# Altium schematic sheet Schematic.SchDoc
size A2
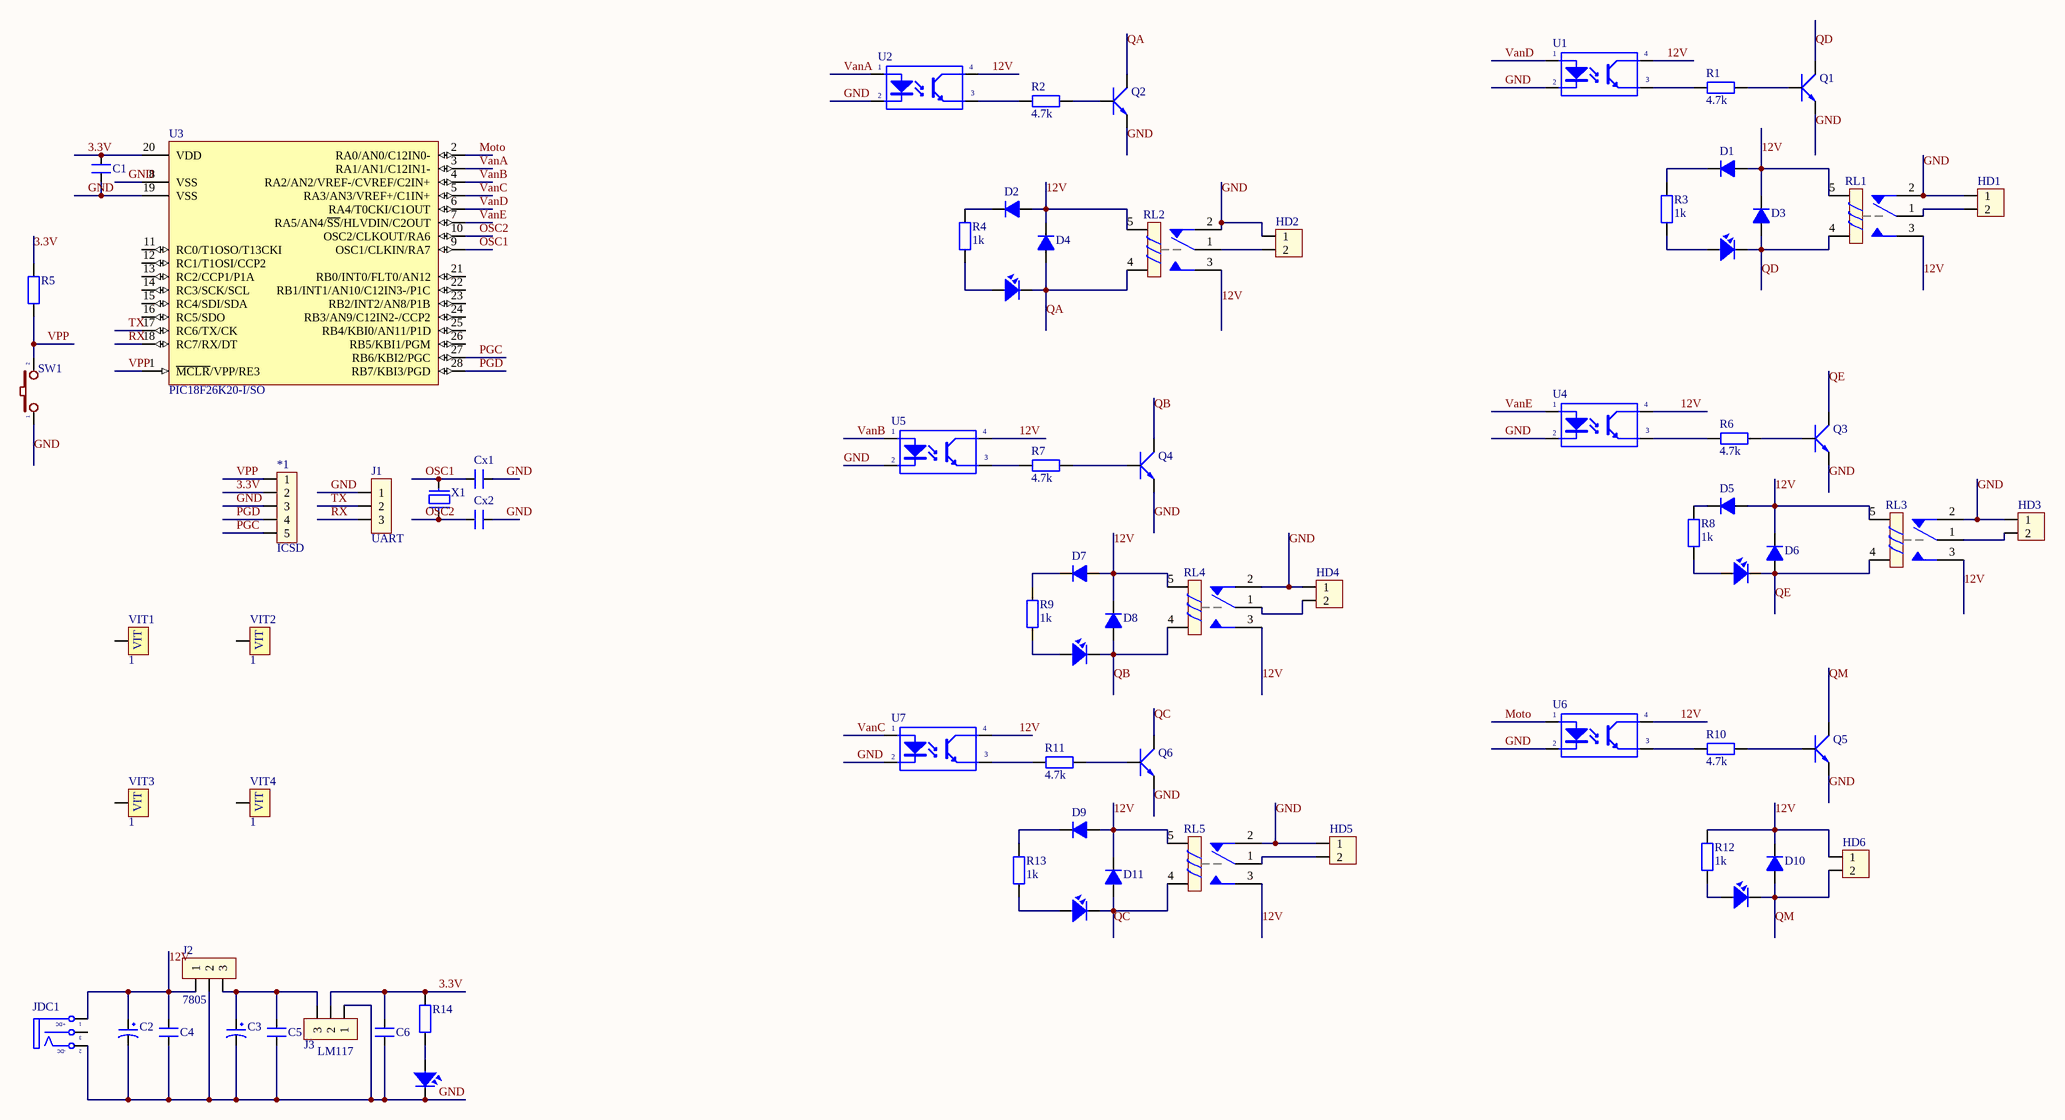
[diagram p0: Schematic.SchDoc]

## Parts
*1  ICSD  [CON5]
C1  104  [CN2]  (value not drawn)
C2  100uF/35V  [CP1.5/3.4]  (value not drawn)
C3  10uF  [CP1/2]  (value not drawn)
C4  104  [CN2]  (value not drawn)
C5  104  [CN2]  (value not drawn)
C6  104  [CN2]  (value not drawn)
Cx1  33pF  [CN1]  (value not drawn)
Cx2  33pF  [CN1]  (value not drawn)
D1  1N4007  [D1A]  (value not drawn)
D2  1N4007  [D1A]  (value not drawn)
D3  1N4007  [D1A]  (value not drawn)
D4  1N4007  [D1A]  (value not drawn)
D5  1N4007  [D1A]  (value not drawn)
D6  1N4007  [D1A]  (value not drawn)
D7  1N4007  [D1A]  (value not drawn)
D8  1N4007  [D1A]  (value not drawn)
D9  1N4007  [D1A]  (value not drawn)
D10  1N4007  [D1A]  (value not drawn)
D11  1N4007  [D1A]  (value not drawn)
HD1  Header 2  [CON2]  (value not drawn)
HD2  Header 2  [CON2]  (value not drawn)
HD3  Header 2  [CON2]  (value not drawn)
HD4  Header 2  [CON2]  (value not drawn)
HD5  Header 2  [CON2]  (value not drawn)
HD6  Header 2  [CON2]  (value not drawn)
J1  UART  [CON3]
J2  7805  [QTO-220H3]
J3  LM117  [QTO-220H3]
JDC1  Jac DC  [DC-IN]  (value not drawn)
LED1  LED  [LED-5TRED]  (value not drawn)
LED2  LED  [LED-5TRED]  (value not drawn)
LED3  LED  [LED-5TRED]  (value not drawn)
LED4  LED  [LED-5TRED]  (value not drawn)
LED5  LED  [LED-5TRED]  (value not drawn)
LED6  LED  [LED-5TRED]  (value not drawn)
LED7  LED  [LED-5TRED]  (value not drawn)
Q1  C1815  [QTO-92]  (value not drawn)
Q2  C1815  [QTO-92]  (value not drawn)
Q3  C1815  [QTO-92]  (value not drawn)
Q4  C1815  [QTO-92]  (value not drawn)
Q5  C1815  [QTO-92]  (value not drawn)
Q6  C1815  [QTO-92]  (value not drawn)
R1  4.7k  [R1/4W]
R2  4.7k  [R1/4W]
R3  1k  [R1/4W]
R4  1k  [R1/4W]
R5  1k  [R1/4W]  (value not drawn)
R6  4.7k  [R1/4W]
R7  4.7k  [R1/4W]
R8  1k  [R1/4W]
R9  1k  [R1/4W]
R10  4.7k  [R1/4W]
R11  4.7k  [R1/4W]
R12  1k  [R1/4W]
R13  1k  [R1/4W]
R14  1k  [R1/4W]  (value not drawn)
RL1  Relay 10A/12V  [RL_SPDT_10A]  (value not drawn)
RL2  Relay 10A/12V  [RL_SPDT_10A]  (value not drawn)
RL3  Relay 10A/12V  [RL_SPDT_10A]  (value not drawn)
RL4  Relay 10A/12V  [RL_SPDT_10A]  (value not drawn)
RL5  Relay 10A/12V  [RL_SPDT_10A]  (value not drawn)
SW1  SW  [SW2]  (value not drawn)
U1  PC817  [DIP4/W0.3]  (value not drawn)
U2  PC817  [DIP4/W0.3]  (value not drawn)
U3  PIC18F26K20-I/SO  [SOIC-SO28_N]
U4  PC817  [DIP4/W0.3]  (value not drawn)
U5  PC817  [DIP4/W0.3]  (value not drawn)
U6  PC817  [DIP4/W0.3]  (value not drawn)
U7  PC817  [DIP4/W0.3]  (value not drawn)
VIT1  1  [VIT]
VIT2  1  [VIT]
VIT3  1  [VIT]
VIT4  1  [VIT]
X1  4Mhz  [XT2]  (value not drawn)

## Nets
3.3V: *1.2 C1.2 C6.1 J3.2 R5.2 R14.2 U3.20(VDD)
12V: C2.1 C4.1 D1.1(A) D2.1(A) D3.2(K) D4.2(K) D5.1(A) D6.2(K) D7.1(A) D8.2(K) D9.1(A) D10.2(K) D11.2(K) HD6.1 J2.1 JDC1.1(T) R12.2 RL1.3 RL1.5 RL2.3 RL2.5 RL3.3 RL3.5 RL4.3 RL4.5 RL5.3 RL5.5 U1.4(C) U2.4(C) U4.4(C) U5.4(C) U6.4(C) U7.4(C)
GND: *1.3 C1.1 C2.2 C3.2 C4.2 C5.2 C6.2 Cx1.2 Cx2.2 HD1.1 HD2.1 HD3.1 HD4.1 HD5.1 J1.1 J2.2 J3.1 JDC1.2(TN) LED7.2 Q1.1(E) Q2.1(E) Q3.1(E) Q4.1(E) Q5.1(E) Q6.1(E) RL1.2 RL2.2 RL3.2 RL4.2 RL5.2 SW1.1 U1.2(K) U2.2(K) U3.8(VSS) U3.19(VSS) U4.2(K) U5.2(K) U6.2(K) U7.2(K)
Moto: U3.2(RA0/AN0/C12IN0-) U6.1(A)
OSC1: Cx1.1 U3.9(OSC1/CLKIN/RA7) X1.2
OSC2: Cx2.1 U3.10(OSC2/CLKOUT/RA6) X1.1
PGC: *1.5 U3.27(RB6/KBI2/PGC)
PGD: *1.4 U3.28(RB7/KBI3/PGD)
QA: D4.1(A) LED2.2 Q2.2(C) RL2.4
QB: D8.1(A) LED4.2 Q4.2(C) RL4.4
QC: D11.1(A) LED6.2 Q6.2(C) RL5.4
QD: D3.1(A) LED1.2 Q1.2(C) RL1.4
QE: D6.1(A) LED3.2 Q3.2(C) RL3.4
QM: D10.1(A) HD6.2 LED5.2 Q5.2(C)
RX: J1.3 U3.18(RC7/RX/DT)
TX: J1.2 U3.17(RC6/TX/CK)
VanA: U2.1(A) U3.3(RA1/AN1/C12IN1-)
VanB: U3.4(RA2/AN2/VREF-/CVREF/C2IN+) U5.1(A)
VanC: U3.5(RA3/AN3/VREF+/C1IN+) U7.1(A)
VanD: U1.1(A) U3.6(RA4/T0CKI/C1OUT)
VanE: U3.7(RA5/AN4/~{SS}/HLVDIN/C2OUT) U4.1(A)
VPP: *1.1 R5.1 SW1.2 U3.1(~{MCLR}/VPP/RE3)
NetC3_1: C3.1 C5.1 J2.3 J3.3
NetD1_2: D1.2(K) R3.2
NetD2_2: D2.2(K) R4.2
NetD5_2: D5.2(K) R8.2
NetD7_2: D7.2(K) R9.2
NetD9_2: D9.2(K) R13.2
NetHD1_2: HD1.2 RL1.1
NetHD2_2: HD2.2 RL2.1
NetHD3_2: HD3.2 RL3.1
NetHD4_2: HD4.2 RL4.1
NetHD5_2: HD5.2 RL5.1
NetLED1_1: LED1.1 R3.1
NetLED2_1: LED2.1 R4.1
NetLED3_1: LED3.1 R8.1
NetLED4_1: LED4.1 R9.1
NetLED5_1: LED5.1 R12.1
NetLED6_1: LED6.1 R13.1
NetLED7_1: LED7.1 R14.1
NetQ1_3: Q1.3(B) R1.2
NetQ2_3: Q2.3(B) R2.2
NetQ3_3: Q3.3(B) R6.2
NetQ4_3: Q4.3(B) R7.2
NetQ5_3: Q5.3(B) R10.2
NetQ6_3: Q6.3(B) R11.2
NetR1_1: R1.1 U1.3(E)
NetR2_1: R2.1 U2.3(E)
NetR6_1: R6.1 U4.3(E)
NetR7_1: R7.1 U5.3(E)
NetR10_1: R10.1 U6.3(E)
NetR11_1: R11.1 U7.3(E)

Not connected (* = marked no-connect by the designer): JDC1 3(S); U3 11(RC0/T1OSO/T13CKI) 12(RC1/T1OSI/CCP2) 13(RC2/CCP1/P1A) 14(RC3/SCK/SCL) 15(RC4/SDI/SDA) 16(RC5/SDO) 21(RB0/INT0/FLT0/AN12) 22(RB1/INT1/AN10/C12IN3-/P1C) 23(RB2/INT2/AN8/P1B) 24(RB3/AN9/C12IN2-/CCP2) 25(RB4/KBI0/AN11/P1D) 26(RB5/KBI1/PGM); VIT1 VIT1(1); VIT2 VIT1(1); VIT3 VIT1(1); VIT4 VIT1(1)

## Notes on the sheet
- (in symbol DCIN) +DC; -DC

## Library data of the parts
*1 = JP5
C1 C4-C6 = CN2: Cap np 104 => 105pF; Value: 0.1uF; Description: Cap np Cremic Value  104pF => 105pF
C2 = CP3: Cap 100uF/35V - 470uF/16V; Value: 100uF/35V/50V; Description 1: 1000uF/6,3V - 470uF/16V - 330uF - 25V; Description 2: 220uF/35V - 100uF/50V - 63V - 4,7uF/200V; Description 3: 22uF => 33uF100V - 3,3uF => 4,7uF/250V; Description 4: 2,2uF =>3,3uF/350 - 2,2uF/400V - 1uF/450V
C3 = CP1: Cap P  0,1uF < 22uF , 16 - 50V; Value: 10uF/50V; Description 1: 10 => 220uF/6,3V/10V - 10uF => 100uF/16V; Description 2: 0,1uF => 33uF/50V - 10uF => 22uF/63V; Description 3: 0,47uF => 10uF/100V
Cx1 Cx2 = CN0: Cremic For Xtal 1pF => 100pF; Description: Cap np Cremic value 1pF => 100pF; Value: 33pF
D1-D11 = D1A: Diode 1A; Value: 1N4007
HD1-HD6 = Hed2: Header 2 (Green); Value: Header 2
J1-J3 = JP3: Jumper 3; Value: J3
JDC1 = DCIN: Jac DC input; Value: Jac DC
LED1-LED7 = LED: LED Single colour Green and Red; Value: LED 3 ly Single Colour; Description: LED 5 ly Single Colour; Description: Led  Vuong
Q1-Q6 = C1815: NPN 600mW, ECB; Value: C1815
R1-R14 = R1/4W: Resistor 1/4W; Value: R1/4W - 1K
RL1-RL5 = Relay 1: Relay SPDT,10A - 12VDC 5 Pin; Value: Relay SPDT, 10A, 12V
SW1 = SW2: Switch button 2 pin; Value: SW chip 2 pin
U1 U2 U4-U7 = PC817: Single Opto; Value: PC817
U3 = PIC18F26K20-I/SO: Flash Microcontroller with 10-Bit A/D and nanoWatt Technology, 64K Flash, 28-Pin SOIC, Industrial Temperature Range; FirstPublished: 29-Jan-2009; LatestRevisionDate: 02-Dec-2009; LatestRevisionNote: Updated to datasheet revision F, Sep-2009; DatasheetVersion: revF, Sep-2009; PackageVersion: revBB, Aug-2009; PackageReference: SOIC-SO28; Publisher: Altium Limited; PackageDescription: 28-Lead Plastic Small Outline (SO) - Wide 7.50mm Body [SOIC]; Supplier 1: Digi-Key; Supplier Part Number 1: PIC18F26K20-I/SO-ND; Supplier 2: Farnell; Supplier Part Number 2: 1439580; Supplier 3: Newark; Supplier Part Number 3: 88K6005; Code_JEDEC: MS-013; ComponentLink1Description: Datasheet; ComponentLink1URL: http://ww1.microchip.com/downloads/en/DeviceDoc/41303F.pdf; ComponentLink2Description: Packaging Specification; ComponentLink2URL: http://www.microchip.com/stellent/groups/techpub_sg/documents/packagingspec/en012702.pdf; ComponentLink3Description: Microchip.com Home; ComponentLink3URL: http://www.microchip.com/
VIT1-VIT4 = VIT: Oc Vit
X1 = XT2: Crystal For all Crystal 2pin.; Value: 4Mhz